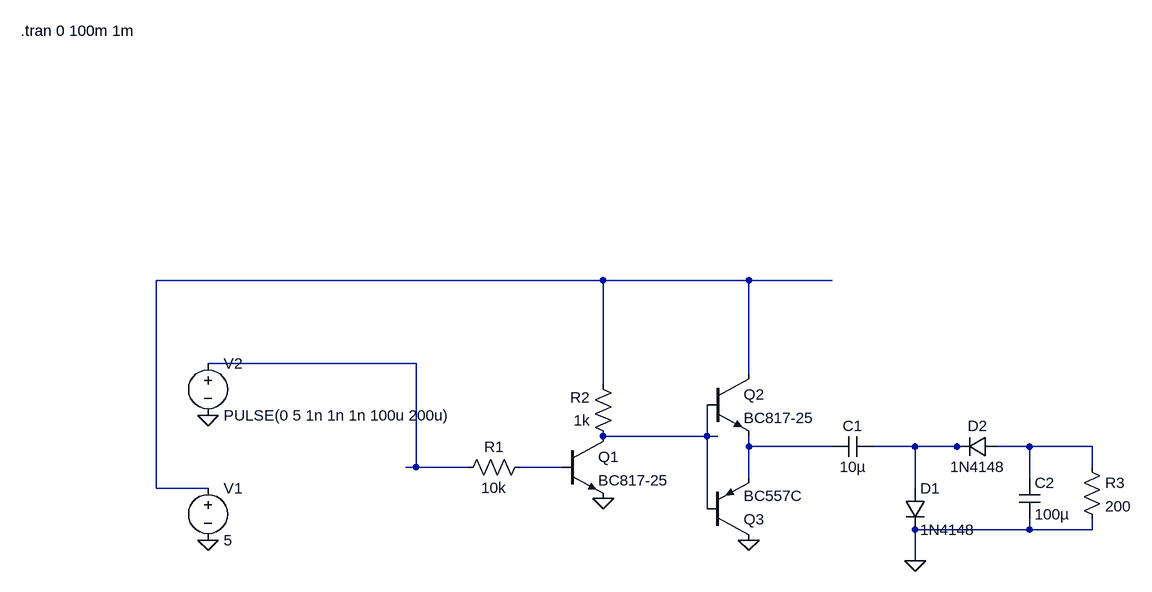
[diagram p0: schematic charge_pump_from_uc.asc]
charge_pump_from_uc.asc, the LTspice schematic file:
Version 4
SHEET 1 1508 680
WIRE 688 -256 0 -256
WIRE 912 -256 688 -256
WIRE 1040 -256 912 -256
WIRE 400 -128 80 -128
WIRE 912 -112 912 -256
WIRE 688 -96 688 -256
WIRE 848 -16 848 -64
WIRE 848 -16 688 -16
WIRE 864 -16 848 -16
WIRE 912 0 912 -16
WIRE 1040 0 912 0
WIRE 1168 0 1104 0
WIRE 1232 0 1168 0
WIRE 1248 0 1232 0
WIRE 1344 0 1296 0
WIRE 1440 0 1344 0
WIRE 400 32 400 -128
WIRE 400 32 384 32
WIRE 480 32 400 32
WIRE 624 32 560 32
WIRE 1440 32 1440 0
WIRE 912 48 912 0
WIRE 1344 48 1344 0
WIRE 0 64 0 -256
WIRE 80 64 0 64
WIRE 1168 64 1168 0
WIRE 848 96 848 -16
WIRE 1344 128 1344 112
WIRE 1344 128 1168 128
WIRE 1440 128 1440 112
WIRE 1440 128 1344 128
WIRE 1168 176 1168 128
FLAG 80 144 0
FLAG 80 -48 0
FLAG 688 80 0
FLAG 912 144 0
FLAG 1168 176 0
SYMBOL voltage 80 48 R0
WINDOW 123 0 0 Left 0
WINDOW 39 0 0 Left 0
SYMATTR InstName V1
SYMATTR Value 5
SYMBOL voltage 80 -144 R0
WINDOW 123 0 0 Left 0
WINDOW 39 0 0 Left 0
SYMATTR InstName V2
SYMATTR Value PULSE(0 5 1n 1n 1n 100u 200u)
SYMBOL npn 624 -16 R0
SYMATTR InstName Q1
SYMATTR Value BC817-25
SYMBOL res 576 16 R90
WINDOW 0 0 56 VBottom 2
WINDOW 3 32 56 VTop 2
SYMATTR InstName R1
SYMATTR Value 10k
SYMBOL res 704 0 R180
WINDOW 0 36 76 Left 2
WINDOW 3 36 40 Left 2
SYMATTR InstName R2
SYMATTR Value 1k
SYMBOL npn 848 -112 R0
SYMATTR InstName Q2
SYMATTR Value BC817-25
SYMBOL pnp 848 144 M180
SYMATTR InstName Q3
SYMATTR Value BC557C
SYMBOL cap 1104 -16 R90
WINDOW 0 0 32 VBottom 2
WINDOW 3 32 32 VTop 2
SYMATTR InstName C1
SYMATTR Value 10µ
SYMBOL diode 1152 64 R0
SYMATTR InstName D1
SYMATTR Value 1N4148
SYMBOL diode 1296 -16 R90
WINDOW 0 0 32 VBottom 2
WINDOW 3 32 32 VTop 2
SYMATTR InstName D2
SYMATTR Value 1N4148
SYMBOL cap 1328 48 R0
SYMATTR InstName C2
SYMATTR Value 100µ
SYMBOL res 1424 16 R0
SYMATTR InstName R3
SYMATTR Value 200
TEXT -208 -640 Left 2 !.tran 0 100m 1m

The netlist it stands for:
* charge_pump_from_uc.asc
V1 N001 0 5
V2 N002 0 PULSE(0 5 1n 1n 1n 100u 200u)
Q1 N003 N007 0 0 BC817-25
R1 N007 N002 10k
R2 N003 N001 1k
Q2 N001 N003 N004 0 BC817-25
Q3 0 N003 N004 0 BC557C
C1 N005 N004 10µ
D1 N005 0 1N4148
D2 N006 N005 1N4148
C2 N006 0 100µ
R3 N006 0 200
.model D D
.lib standard.dio
.model NPN NPN
.model PNP PNP
.lib standard.bjt
.tran 0 100m 1m
.backanno
.end